# Altium schematic sheet ADC0809电压采集.SchDoc
size A4
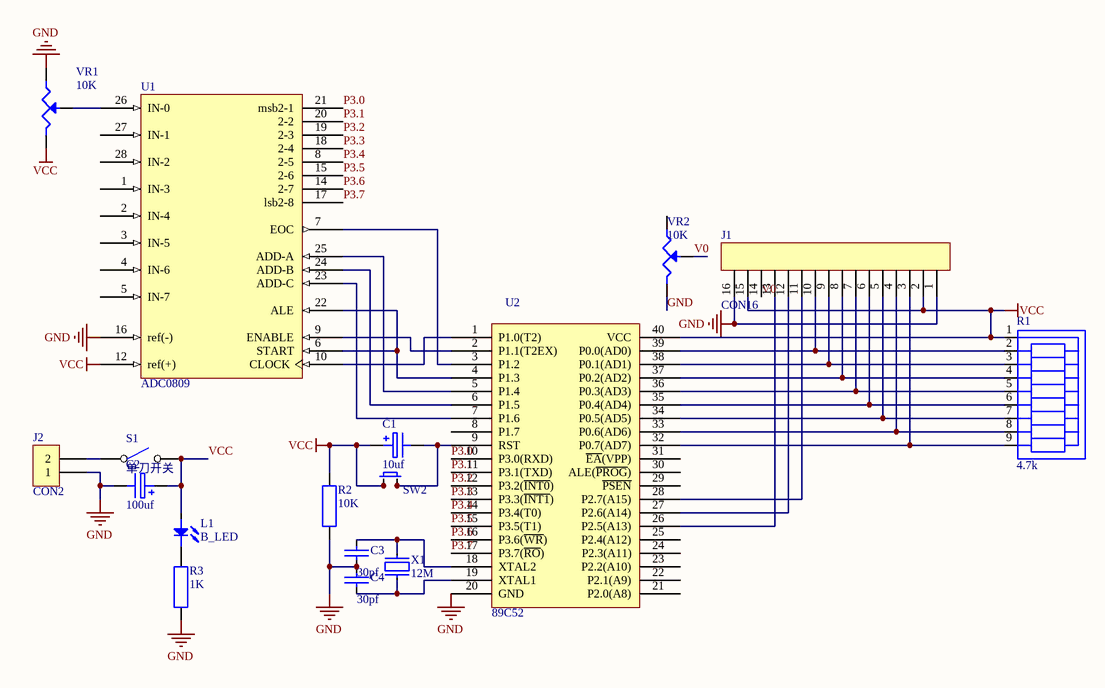
[diagram p0: ADC0809电压采集.SchDoc]

## Parts
?  SW2  [SW2]
C1  10uf  [ELEC2]
C2  100uf  [ELEC2]
C3  30pf  [RAD0.1]
C4  30pf  [RAD0.1]
J1  CON16  [SIP16]
J2  CON2  [SIP2]
L1  B_LED  [LED]
R1  4.7k  [SIP9]
R2  10K  [RES]
R3  1K  [RES]
S1  单刀开关  [SW]
U1  ADC0809  [DIP28]
U2  89C52  [DIP40]
VR1  10K  [VR]
VR2  10K  [VR]
X1  12M  [XTAL]

## Nets
GND: C2.2 C3.2 C4.1 J1.1 J1.16 J2.1 R2.1 R3.1 U1.13(GND) U1.16(ref(-)) U2.20(GND) VR1.1 VR2.3
VCC: ?.1 C1.1 C2.1 J1.2 J1.15 L1.A R1.1 R2.2 S1.2 U1.12(ref(+)) U2.40(VCC) VR1.3
P3.0: U1.21(msb2-1) U2.10(P3.0(RXD))
P3.1: U1.20(2-2) U2.11(P3.1(TXD))
P3.2: U1.19(2-3) U2.12(P3.2(~{INT0}))
P3.3: U1.18(2-4) U2.13(P3.3(~{INT1}))
P3.4: U1.8(2-5) U2.14(P3.4(T0))
P3.5: U1.15(2-6) U2.15(P3.5(T1))
P3.6: U1.14(2-7) U2.16(P3.6(~{WR}))
P3.7: U1.17(lsb2-8) U2.17(P3.7(~{RO}))
V0: J1.14 VR2.2
Net?_4: ?.4 C1.2 U2.9(RST)
NetC3_1: C3.1 U2.18(XTAL2) X1.2
NetC4_2: C4.2 U2.19(XTAL1) X1.1
NetJ1_3: J1.3 R1.9 U2.32(P0.7(AD7))
NetJ1_4: J1.4 R1.8 U2.33(P0.6(AD6))
NetJ1_5: J1.5 R1.7 U2.34(P0.5(AD5))
NetJ1_6: J1.6 R1.6 U2.35(P0.4(AD4))
NetJ1_7: J1.7 R1.5 U2.36(P0.3(AD3))
NetJ1_8: J1.8 R1.4 U2.37(P0.2(AD2))
NetJ1_9: J1.9 R1.3 U2.38(P0.1(AD1))
NetJ1_10: J1.10 R1.2 U2.39(P0.0(AD0))
NetJ1_11: J1.11 U2.28(P2.7(A15))
NetJ1_12: J1.12 U2.27(P2.6(A14))
NetJ1_13: J1.13 U2.26(P2.5(A13))
NetJ2_2: J2.2 S1.1
NetL1_K: L1.K R3.2
NetU1_6: U1.6(START) U1.22(ALE) U2.4(P1.3)
NetU1_7: U1.7(EOC) U2.3(P1.2)
NetU1_9: U1.9(ENABLE) U2.2(P1.1(T2EX))
NetU1_10: U1.10(CLOCK) U2.1(P1.0(T2))
NetU1_23: U1.23(ADD-C) U2.7(P1.6)
NetU1_24: U1.24(ADD-B) U2.6(P1.5)
NetU1_25: U1.25(ADD-A) U2.5(P1.4)
NetU1_26: U1.26(IN-0) VR1.2

Not connected (* = marked no-connect by the designer): ? 2 3; U1 1(IN-3) 2(IN-4) 3(IN-5) 4(IN-6) 5(IN-7) 27(IN-1) 28(IN-2); U2 8(P1.7) 21(P2.0(A8)) 22(P2.1(A9)) 23(P2.2(A10)) 24(P2.3(A11)) 25(P2.4(A12)) 29(~{PSEN}) 30(ALE(~{PROG})) 31(~{EA}(VPP)); VR2 1

## Library data of the parts
C1 C2 = ELECTRO1: Electrolytic Capacitor
C3 C4 = CAP
J1 = CON16: SOCKET
J2 = CON2: Connector
R1 = RES*8
R2 R3 = RES
VR1 VR2 = POT1
X1 = CRYSTAL